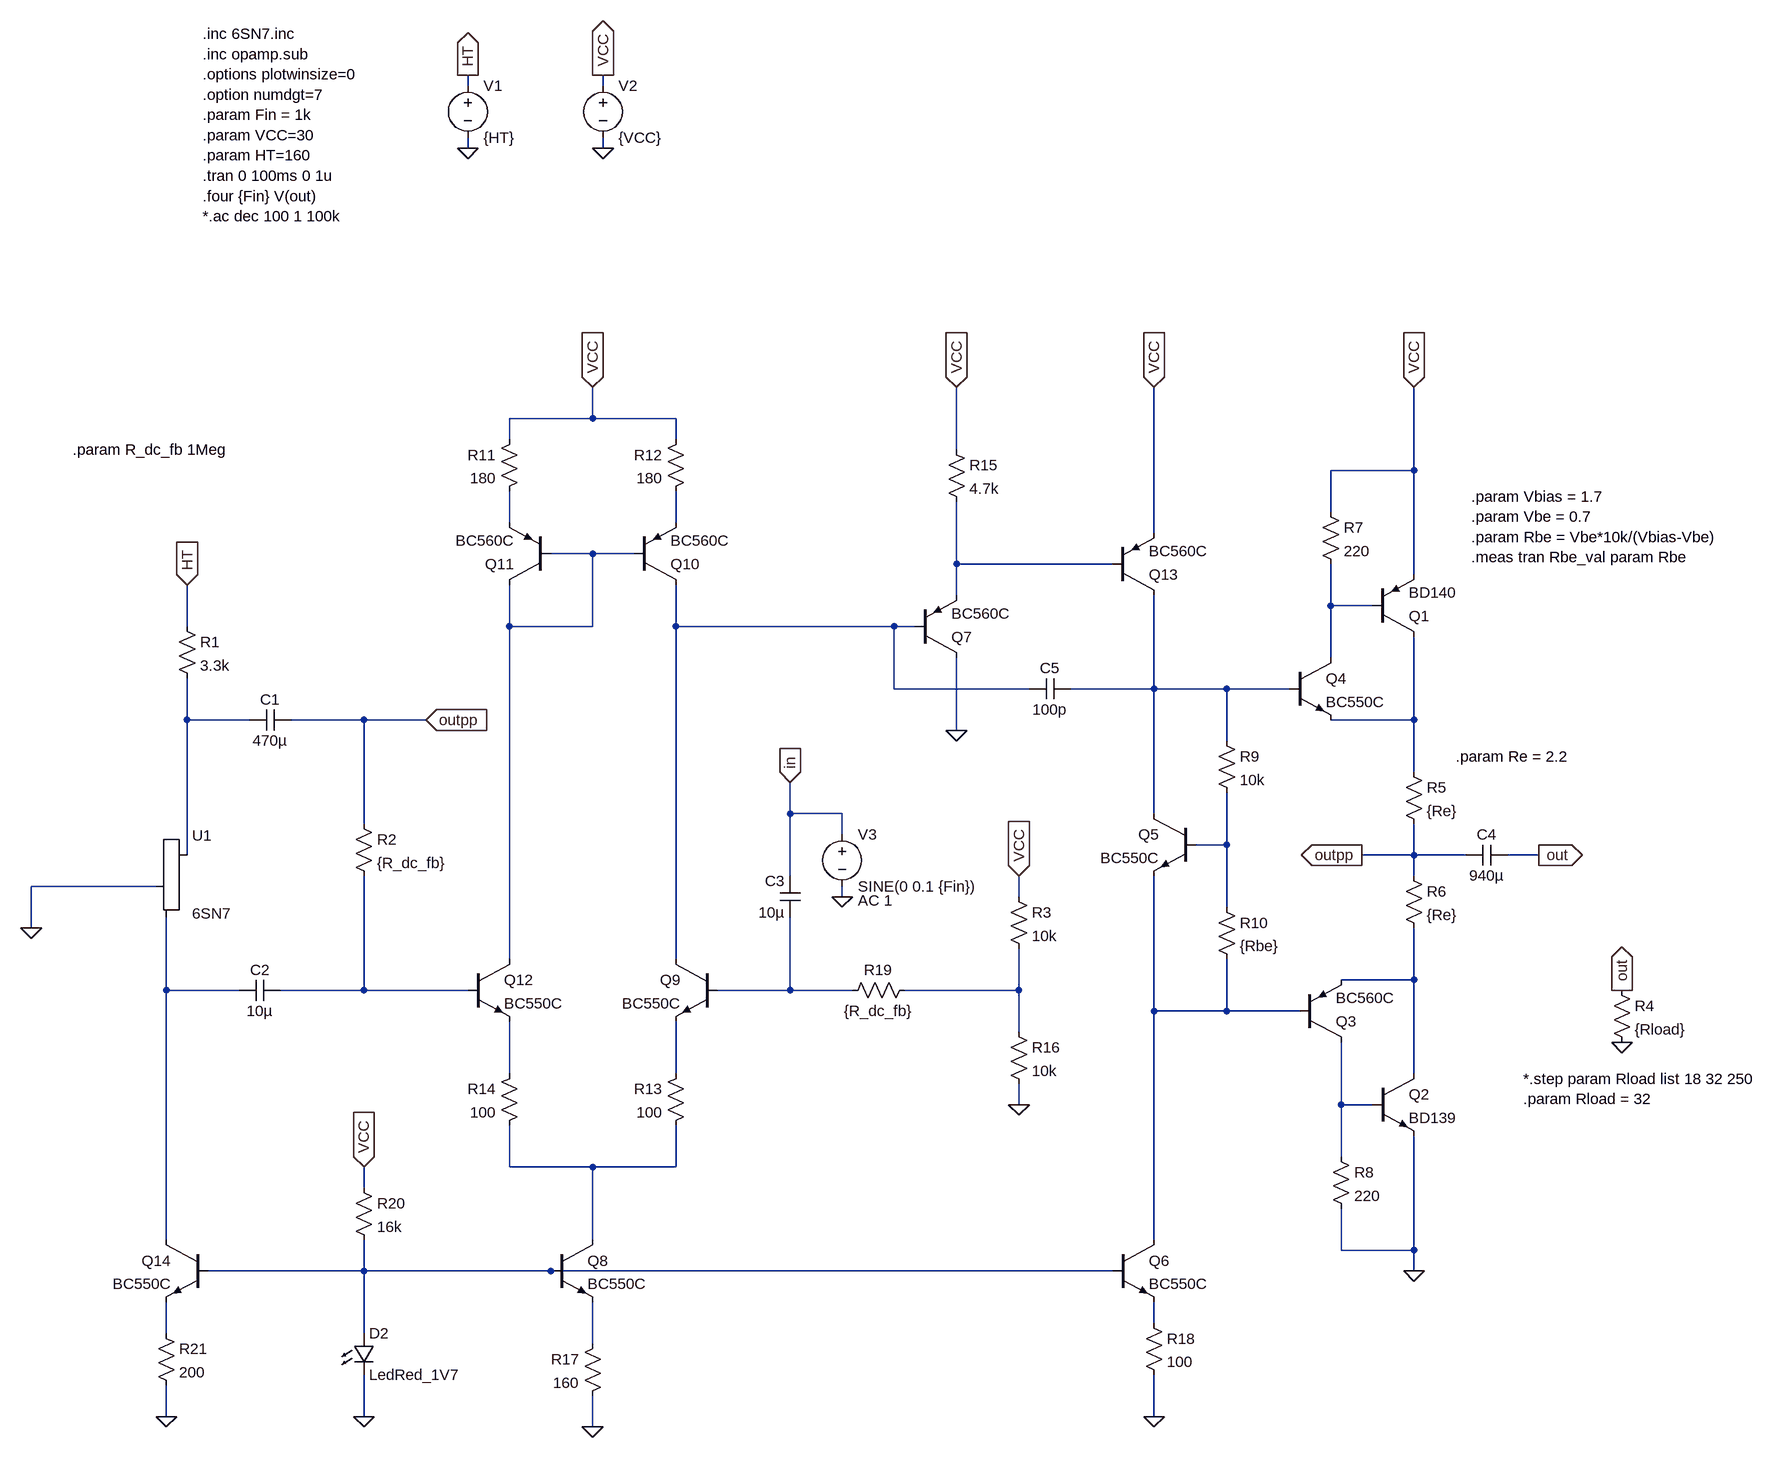
[diagram p0: schematic Super triode discrete op amp pnp.asc]
Super triode discrete op amp pnp.asc, the LTspice schematic file:
Version 4
SHEET 1 2184 1244
WIRE 192 -880 192 -896
WIRE 400 -880 400 -896
WIRE 192 -784 192 -800
WIRE 400 -784 400 -800
WIRE 384 -368 384 -416
WIRE 384 -368 256 -368
WIRE 512 -368 384 -368
WIRE 256 -336 256 -368
WIRE 512 -336 512 -368
WIRE 944 -320 944 -416
WIRE 1648 -288 1648 -416
WIRE 1648 -288 1520 -288
WIRE 1520 -224 1520 -288
WIRE 256 -208 256 -256
WIRE 512 -208 512 -256
WIRE 1248 -192 1248 -416
WIRE 384 -160 320 -160
WIRE 448 -160 384 -160
WIRE 944 -144 944 -240
WIRE 1184 -144 944 -144
WIRE 1648 -128 1648 -288
WIRE 944 -96 944 -144
WIRE 1520 -80 1520 -144
WIRE 1584 -80 1520 -80
WIRE -240 -48 -240 -112
WIRE 256 -48 256 -112
WIRE 384 -48 384 -160
WIRE 384 -48 256 -48
WIRE 512 -48 512 -112
WIRE 848 -48 512 -48
WIRE 880 -48 848 -48
WIRE 1520 0 1520 -80
WIRE 848 48 848 -48
WIRE 1056 48 848 48
WIRE 1248 48 1248 -96
WIRE 1248 48 1120 48
WIRE 1360 48 1248 48
WIRE 1456 48 1360 48
WIRE -240 96 -240 32
WIRE -144 96 -240 96
WIRE 32 96 -80 96
WIRE 128 96 32 96
WIRE 1648 96 1648 -32
WIRE 1648 96 1520 96
WIRE 944 112 944 0
WIRE 1360 128 1360 48
WIRE 1648 176 1648 96
WIRE 688 240 688 192
WIRE 768 240 688 240
WIRE 1248 240 1248 48
WIRE 32 256 32 96
WIRE 768 272 768 240
WIRE 1360 288 1360 208
WIRE 1360 288 1312 288
WIRE -240 304 -240 96
WIRE 1648 304 1648 256
WIRE 1648 304 1568 304
WIRE 1728 304 1648 304
WIRE 1840 304 1792 304
WIRE 688 336 688 240
WIRE 1648 336 1648 304
WIRE -288 352 -480 352
WIRE 768 368 768 352
WIRE 1040 368 1040 336
WIRE 1360 384 1360 288
WIRE -480 416 -480 352
WIRE 256 464 256 -48
WIRE 512 464 512 -48
WIRE 1648 496 1648 416
WIRE 1648 496 1536 496
WIRE -272 512 -272 400
WIRE -160 512 -272 512
WIRE 32 512 32 336
WIRE 32 512 -96 512
WIRE 192 512 32 512
WIRE 688 512 688 400
WIRE 688 512 576 512
WIRE 784 512 688 512
WIRE 1040 512 1040 448
WIRE 1040 512 864 512
WIRE 1248 544 1248 336
WIRE 1360 544 1360 464
WIRE 1360 544 1248 544
WIRE 1472 544 1360 544
WIRE 1040 576 1040 512
WIRE 256 640 256 560
WIRE 512 640 512 560
WIRE 1648 640 1648 496
WIRE 1040 688 1040 656
WIRE 1536 688 1536 592
WIRE 1584 688 1536 688
WIRE 1536 768 1536 688
WIRE 256 784 256 720
WIRE 384 784 256 784
WIRE 512 784 512 720
WIRE 512 784 384 784
WIRE 32 816 32 784
WIRE -272 896 -272 512
WIRE 384 896 384 784
WIRE 1248 896 1248 544
WIRE 1536 912 1536 848
WIRE 1648 912 1648 736
WIRE 1648 912 1536 912
WIRE 32 944 32 896
WIRE 32 944 -208 944
WIRE 320 944 32 944
WIRE 1184 944 320 944
WIRE 1648 944 1648 912
WIRE 1248 1024 1248 992
WIRE -272 1040 -272 992
WIRE 32 1040 32 944
WIRE 384 1056 384 992
WIRE -272 1168 -272 1120
WIRE 32 1168 32 1104
WIRE 1248 1168 1248 1104
WIRE 384 1184 384 1136
FLAG 192 -784 0
FLAG 192 -896 HT
IOPIN 192 -896 Out
FLAG -240 -112 HT
IOPIN -240 -112 In
FLAG 400 -784 0
FLAG 400 -896 VCC
IOPIN 400 -896 Out
FLAG 128 96 outpp
IOPIN 128 96 In
FLAG -480 416 0
FLAG 768 368 0
FLAG 1648 -416 VCC
IOPIN 1648 -416 In
FLAG 1840 304 out
IOPIN 1840 304 Out
FLAG 1968 512 out
IOPIN 1968 512 Out
FLAG 1968 592 0
FLAG 1648 944 0
FLAG 1568 304 outpp
IOPIN 1568 304 Out
FLAG 1248 1168 0
FLAG 1248 -416 VCC
IOPIN 1248 -416 In
FLAG 944 -416 VCC
IOPIN 944 -416 In
FLAG 944 112 0
FLAG 688 192 in
IOPIN 688 192 In
FLAG 1040 336 VCC
IOPIN 1040 336 In
FLAG 32 784 VCC
IOPIN 32 784 In
FLAG 32 1168 0
FLAG -272 1168 0
FLAG 384 1184 0
FLAG 384 -416 VCC
IOPIN 384 -416 In
FLAG 1040 688 0
SYMBOL voltage 192 -896 R0
SYMATTR InstName V1
SYMATTR Value {HT}
SYMBOL Misc/triode -240 352 R0
SYMATTR InstName U1
SYMATTR Value 6SN7
SYMBOL res -256 -64 R0
SYMATTR InstName R1
SYMATTR Value 3.3k
SYMBOL voltage 400 -896 R0
SYMATTR InstName V2
SYMATTR Value {VCC}
SYMBOL cap -80 80 R90
WINDOW 0 0 32 VBottom 2
WINDOW 3 32 32 VTop 2
SYMATTR InstName C1
SYMATTR Value 470µ
SYMBOL cap -96 496 R90
WINDOW 0 0 32 VBottom 2
WINDOW 3 32 32 VTop 2
SYMATTR InstName C2
SYMATTR Value 10µ
SYMBOL res 16 240 R0
SYMATTR InstName R2
SYMATTR Value {R_dc_fb}
SYMBOL voltage 768 256 R0
WINDOW 123 24 118 Left 2
SYMATTR Value2 AC 1
SYMATTR InstName V3
SYMATTR Value SINE(0 0.1 {Fin})
SYMBOL cap 704 400 R180
WINDOW 0 24 56 Left 2
WINDOW 3 24 8 Left 2
SYMATTR InstName C3
SYMATTR Value 10µ
SYMBOL res 1952 496 R0
SYMATTR InstName R4
SYMATTR Value {Rload}
SYMBOL res 1632 160 R0
SYMATTR InstName R5
SYMATTR Value {Re}
SYMBOL res 1632 320 R0
SYMATTR InstName R6
SYMATTR Value {Re}
SYMBOL pnp 1584 -32 M180
SYMATTR InstName Q1
SYMATTR Value BD140
SYMBOL npn 1584 640 R0
SYMATTR InstName Q2
SYMATTR Value BD139
SYMBOL cap 1792 288 R90
WINDOW 0 0 32 VBottom 2
WINDOW 3 32 32 VTop 2
SYMATTR InstName C4
SYMATTR Value 940µ
SYMBOL pnp 1472 592 M180
SYMATTR InstName Q3
SYMATTR Value BC560C
SYMBOL npn 1456 0 R0
SYMATTR InstName Q4
SYMATTR Value BC550C
SYMBOL res 1504 -240 R0
SYMATTR InstName R7
SYMATTR Value 220
SYMBOL res 1520 752 R0
SYMATTR InstName R8
SYMATTR Value 220
SYMBOL npn 1312 240 M0
SYMATTR InstName Q5
SYMATTR Value BC550C
SYMBOL res 1344 112 R0
SYMATTR InstName R9
SYMATTR Value 10k
SYMBOL res 1344 368 R0
SYMATTR InstName R10
SYMATTR Value {Rbe}
SYMBOL npn 1184 896 R0
SYMATTR InstName Q6
SYMATTR Value BC550C
SYMBOL cap 1120 32 R90
WINDOW 0 0 32 VBottom 2
WINDOW 3 32 32 VTop 2
SYMATTR InstName C5
SYMATTR Value 100p
SYMBOL res 272 -352 M0
SYMATTR InstName R11
SYMATTR Value 180
SYMBOL res 528 -352 M0
SYMATTR InstName R12
SYMATTR Value 180
SYMBOL res 528 624 M0
SYMATTR InstName R13
SYMATTR Value 100
SYMBOL res 272 624 M0
SYMATTR InstName R14
SYMATTR Value 100
SYMBOL res 928 -336 R0
SYMATTR InstName R15
SYMATTR Value 4.7k
SYMBOL res 400 1040 M0
SYMATTR InstName R17
SYMATTR Value 160
SYMBOL pnp 1184 -96 M180
SYMATTR InstName Q13
SYMATTR Value BC560C
SYMBOL res 1232 1008 R0
SYMATTR InstName R18
SYMATTR Value 100
SYMBOL res 880 496 R90
WINDOW 0 0 56 VBottom 2
WINDOW 3 32 56 VTop 2
SYMATTR InstName R19
SYMATTR Value {R_dc_fb}
SYMBOL LED 16 1040 R0
SYMATTR InstName D2
SYMATTR Value LedRed_1V7
SYMBOL res 16 800 R0
SYMATTR InstName R20
SYMATTR Value 16k
SYMBOL npn -208 896 M0
SYMATTR InstName Q14
SYMATTR Value BC550C
SYMBOL res -288 1024 R0
SYMATTR InstName R21
SYMATTR Value 200
SYMBOL pnp 448 -112 M180
SYMATTR InstName Q10
SYMATTR Value BC560C
SYMBOL pnp 320 -112 R180
SYMATTR InstName Q11
SYMATTR Value BC560C
SYMBOL npn 576 464 M0
SYMATTR InstName Q9
SYMATTR Value BC550C
SYMBOL npn 192 464 R0
SYMATTR InstName Q12
SYMATTR Value BC550C
SYMBOL npn 320 896 R0
SYMATTR InstName Q8
SYMATTR Value BC550C
SYMBOL pnp 880 0 M180
SYMATTR InstName Q7
SYMATTR Value BC560C
SYMBOL res 1024 352 R0
SYMATTR InstName R3
SYMATTR Value 10k
SYMBOL res 1024 560 R0
SYMATTR InstName R16
SYMATTR Value 10k
TEXT -216 -960 Left 2 !.inc 6SN7.inc\n.inc opamp.sub\n.options plotwinsize=0\n.option numdgt=7\n.param Fin = 1k\n.param VCC=30\n.param HT=160\n.tran 0 100ms 0 1u\n.four {Fin} V(out)\n*.ac dec 100 1 100k
TEXT 1816 648 Left 2 !*.step param Rload list 18 32 250\n.param Rload = 32
TEXT 1736 -248 Left 2 !.param Vbias = 1.7\n.param Vbe = 0.7\n.param Rbe = Vbe*10k/(Vbias-Vbe)\n.meas tran Rbe_val param Rbe
TEXT 1712 152 Left 2 !.param Re = 2.2
TEXT -416 -320 Left 2 !.param R_dc_fb 1Meg

The netlist it stands for:
* Super triode discrete op amp pnp.asc
V1 HT 0 {HT}
XU1 N008 0 N012 6SN7
R1 HT N008 3.3k
V2 VCC 0 {VCC}
C1 outpp N008 470µ
C2 N013 N012 10µ
R2 outpp N013 {R_dc_fb}
V3 in 0 SINE(0 0.1 {Fin}) AC 1
C3 N014 in 10µ
R4 out 0 {Rload}
R5 N009 outpp {Re}
R6 outpp N011 {Re}
Q1 N009 N005 VCC 0 BD140
Q2 N011 N019 0 0 BD139
C4 out outpp 940µ
Q3 N019 N016 N011 0 BC560C
Q4 N005 N007 N009 0 BC550C
R7 VCC N005 220
R8 N019 0 220
Q5 N007 N010 N016 0 BC550C
R9 N007 N010 10k
R10 N010 N016 {Rbe}
Q6 N016 N021 N022 0 BC550C
C5 N007 N006 100p
R11 VCC N001 180
R12 VCC N002 180
R13 N018 N020 100
R14 N017 N020 100
R15 VCC N004 4.7k
R17 N024 0 160
Q13 N007 N004 VCC 0 BC560C
R18 N022 0 100
R19 N015 N014 {R_dc_fb}
D2 N021 0 LedRed_1V7
R20 VCC N021 16k
Q14 N012 N021 N023 0 BC550C
R21 N023 0 200
Q10 N006 N003 N002 0 BC560C
Q11 N003 N003 N001 0 BC560C
Q9 N006 N014 N018 0 BC550C
Q12 N003 N013 N017 0 BC550C
Q8 N020 N021 N024 0 BC550C
Q7 0 N006 N004 0 BC560C
R3 VCC N015 10k
R16 N015 0 10k
.model D D
.lib standard.dio
.model NPN NPN
.model PNP PNP
.lib standard.bjt
.inc 6SN7.inc
.inc opamp.sub
.options plotwinsize=0
.option numdgt=7
.param Fin = 1k
.param VCC=30
.param HT=160
.tran 0 100ms 0 1u
.four {Fin} V(out)
*.ac dec 100 1 100k
*.step param Rload list 18 32 250
.param Rload = 32
.param Vbias = 1.7
.param Vbe = 0.7
.param Rbe = Vbe*10k/(Vbias-Vbe)
.meas tran Rbe_val param Rbe
.param Re = 2.2
.param R_dc_fb 1Meg
.backanno
.end